# Altium schematic sheet RF.SchDoc
size A
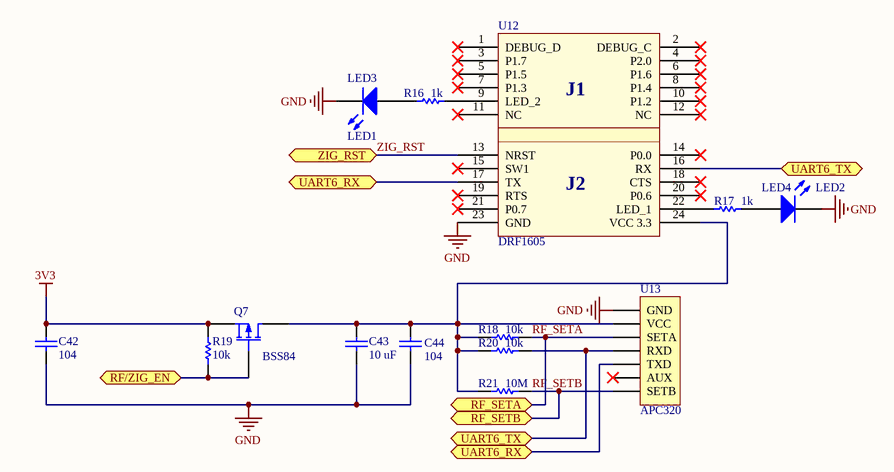
[diagram p0: RF.SchDoc]

## Parts
C42  104  [C0603]
C43  10 uF  [C1210]
C44  104  [C0603]
LED3  LED1  [SM/LED_0603]
LED4  LED2  [SM/LED_0603]
Q7  BSS84  [SOT23-3]
R16  1k  [R0603]
R17  1k  [R0603]
R18  10k  [R0603]
R19  10k  [R0603]
R20  10k  [R0603]
R21  10M  [R0603]
U12  DRF1605  [DRF1605]
U13  APC320  [APC320 - 2D]

## Ports
RF/ZIG_EN, RF_SETA, RF_SETB, UART6_RX, UART6_TX, ZIG_RST

## Nets
3V3: C42.2 Q7.2(S) R19.1
GND: C42.1 C43.1 C44.1 LED3.2(K) LED4.2(K) U12.23(GND) U13.1(GND)
RF/ZIG_EN: Q7.1(G) R19.2 ; port RF/ZIG_EN
RF_SETA: R18.2 U13.3(SETA) ; port RF_SETA
RF_SETB: R21.2 U13.7(SETB) ; port RF_SETB
UART6_RX: U12.17(TX) U13.5(TXD) ; port UART6_RX
UART6_TX: R20.2 U12.16(RX) U13.4(RXD) ; port UART6_TX
ZIG_RST: U12.13(NRST) ; port ZIG_RST
NetC43_2: C43.2 C44.2 Q7.3(D) R18.1 R20.1 R21.1 U12.24(VCC_3.3) U13.2(VCC)
NetLED3_1: LED3.1(A) R16.1
NetLED4_1: LED4.1(A) R17.2
NetR16_2: R16.2 U12.9(LED_2)
NetR17_1: R17.1 U12.22(LED_1)

Not connected (* = marked no-connect by the designer): U12 1(DEBUG_D)* 2(DEBUG_C)* 3(P1.7)* 4(P2.0)* 5(P1.5)* 6(P1.6)* 7(P1.3)* 8(P1.4)* 10(P1.2)* 11(NC)* 12(NC)* 14(P0.0)* 15(SW1)* 18(CTS)* 19(RTS)* 20(P0.6)* 21(P0.7)*; U13 6(AUX)*

## Notes on the sheet
- (in symbol DRF1605) J1; J2

## Library data of the parts
C42-C44 = Cap_SMT: CAP CER 0.1UF 16V Y5V 0402; Manufacturer: Yageo; Manufacturer Part Number: CC0603ZRY5V7BB104; Published: 8-Jun-2000; LatestRevisionDate: 17-Jul-2002; LatestRevisionNote: Re-released for DXP Platform.; PackageReference: C0603; Publisher: Altium Limited; Digi-Key Part Number: 311-1047-1-ND; Unit Price: 0.00648
  C42 C44: Value: 104
  C43: Value: 10 uF
LED3 LED4 = LED: LED GREEN 0.2MM 13MCD 0402 SMD; Manufacturer: Lite-On Inc; Manufacturer Part Number: LTST-C191KGKT; Published: 8-Jun-2000; LatestRevisionDate: 17-Jul-2002; LatestRevisionNote: Re-released for DXP Platform.; PackageVersion: Feb-2002; PackageReference: 3.2X1.6X1.1; Publisher: Altium Limited; Digi-Key Part Number: 511-1592-2-ND; Unit Price: 0.03780; Value: LED GREEN
Q7 = MOSFET-P GSD: MOSFET P-CH 50V 130MA SOT23-3; Manufacturer: Diodes Inc; Manufacturer Part Number: BSS84-7-F; Published: 8-Jun-2000; LatestRevisionDate: 17-Jul-2002; LatestRevisionNote: Re-released for DXP Platform.; PackageVersion: 1995/1996; PackageReference: E3; Publisher: Altium Limited; Digi-Key Part Number: BSS84-FDITR-ND; Unit Price: 0.06000
R16-R21 = R_SMD5: Resistor SMD 5%; Manufacturer: Panasonic Electronic Components; Manufacturer Part Number: ERJ-2RKF3241X; Published: 8-Jun-2000; LatestRevisionDate: 17-Jul-2002; LatestRevisionNote: Re-released for DXP Platform.; PackageReference: R0603; Publisher: Altium Limited; Digi-Key Part Number: P3.24KLTR-ND; Unit Price: 0.00203
  R16 R17: Value: 1k
  R18-R20: Value: 10k
  R21: Value: 10M